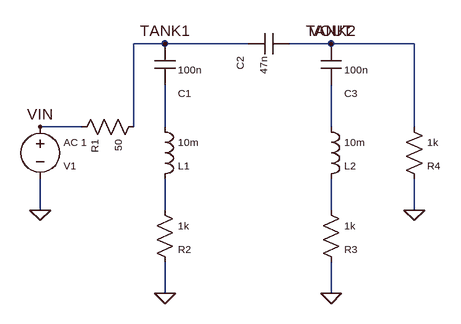
[diagram p0: schematic rlc_bandpass.asc]
rlc_bandpass.asc, the LTspice schematic file:
Version 4
SHEET 1 1096 1096
WIRE 100 420 164 420
WIRE 244 420 244 292
WIRE 244 292 292 292
WIRE 100 500 100 548
WIRE 292 356 292 420
WIRE 292 500 292 548
WIRE 292 628 292 676
WIRE 292 292 420 292
WIRE 484 292 548 292
WIRE 548 356 548 420
WIRE 548 500 548 548
WIRE 548 628 548 676
WIRE 548 292 676 292
WIRE 676 292 676 420
WIRE 676 500 676 548
FLAG 100 420 VIN
FLAG 292 292 TANK1
FLAG 548 292 TANK2
FLAG 548 292 VOUT
SYMBOL voltage 100 404 R0
SYMATTR InstName V1
WINDOW 0 36 76 Left 1
SYMATTR Value AC 1
WINDOW 3 36 40 Left 1
FLAG 100 548 0
SYMBOL res 260 404 R90
SYMATTR InstName R1
WINDOW 0 36 76 Left 1
SYMATTR Value 50
WINDOW 3 36 40 Left 1
SYMBOL cap 276 292 R0
SYMATTR InstName C1
WINDOW 0 36 76 Left 1
SYMATTR Value 100n
WINDOW 3 36 40 Left 1
SYMBOL ind 276 404 R0
SYMATTR InstName L1
WINDOW 0 36 76 Left 1
SYMATTR Value 10m
WINDOW 3 36 40 Left 1
SYMBOL res 276 532 R0
SYMATTR InstName R2
WINDOW 0 36 76 Left 1
SYMATTR Value 1k
WINDOW 3 36 40 Left 1
FLAG 292 676 0
SYMBOL cap 484 276 R90
SYMATTR InstName C2
WINDOW 0 36 76 Left 1
SYMATTR Value 47n
WINDOW 3 36 40 Left 1
SYMBOL cap 532 292 R0
SYMATTR InstName C3
WINDOW 0 36 76 Left 1
SYMATTR Value 100n
WINDOW 3 36 40 Left 1
SYMBOL ind 532 404 R0
SYMATTR InstName L2
WINDOW 0 36 76 Left 1
SYMATTR Value 10m
WINDOW 3 36 40 Left 1
SYMBOL res 532 532 R0
SYMATTR InstName R3
WINDOW 0 36 76 Left 1
SYMATTR Value 1k
WINDOW 3 36 40 Left 1
FLAG 548 676 0
SYMBOL res 660 404 R0
SYMATTR InstName R4
WINDOW 0 36 76 Left 1
SYMATTR Value 1k
WINDOW 3 36 40 Left 1
FLAG 676 548 0

The netlist it stands for:
* rlc_bandpass.asc
V1 VIN 0 AC 1
R1 TANK1 VIN 50
C1 TANK1 N001 100n
L1 N001 N002 10m
R2 N002 0 1k
C2 VOUT TANK1 47n
C3 VOUT N003 100n
L2 N003 N004 10m
R3 N004 0 1k
R4 VOUT 0 1k
.backanno
.end